# EAGLE schematic main (EAGLE 7.2.0)
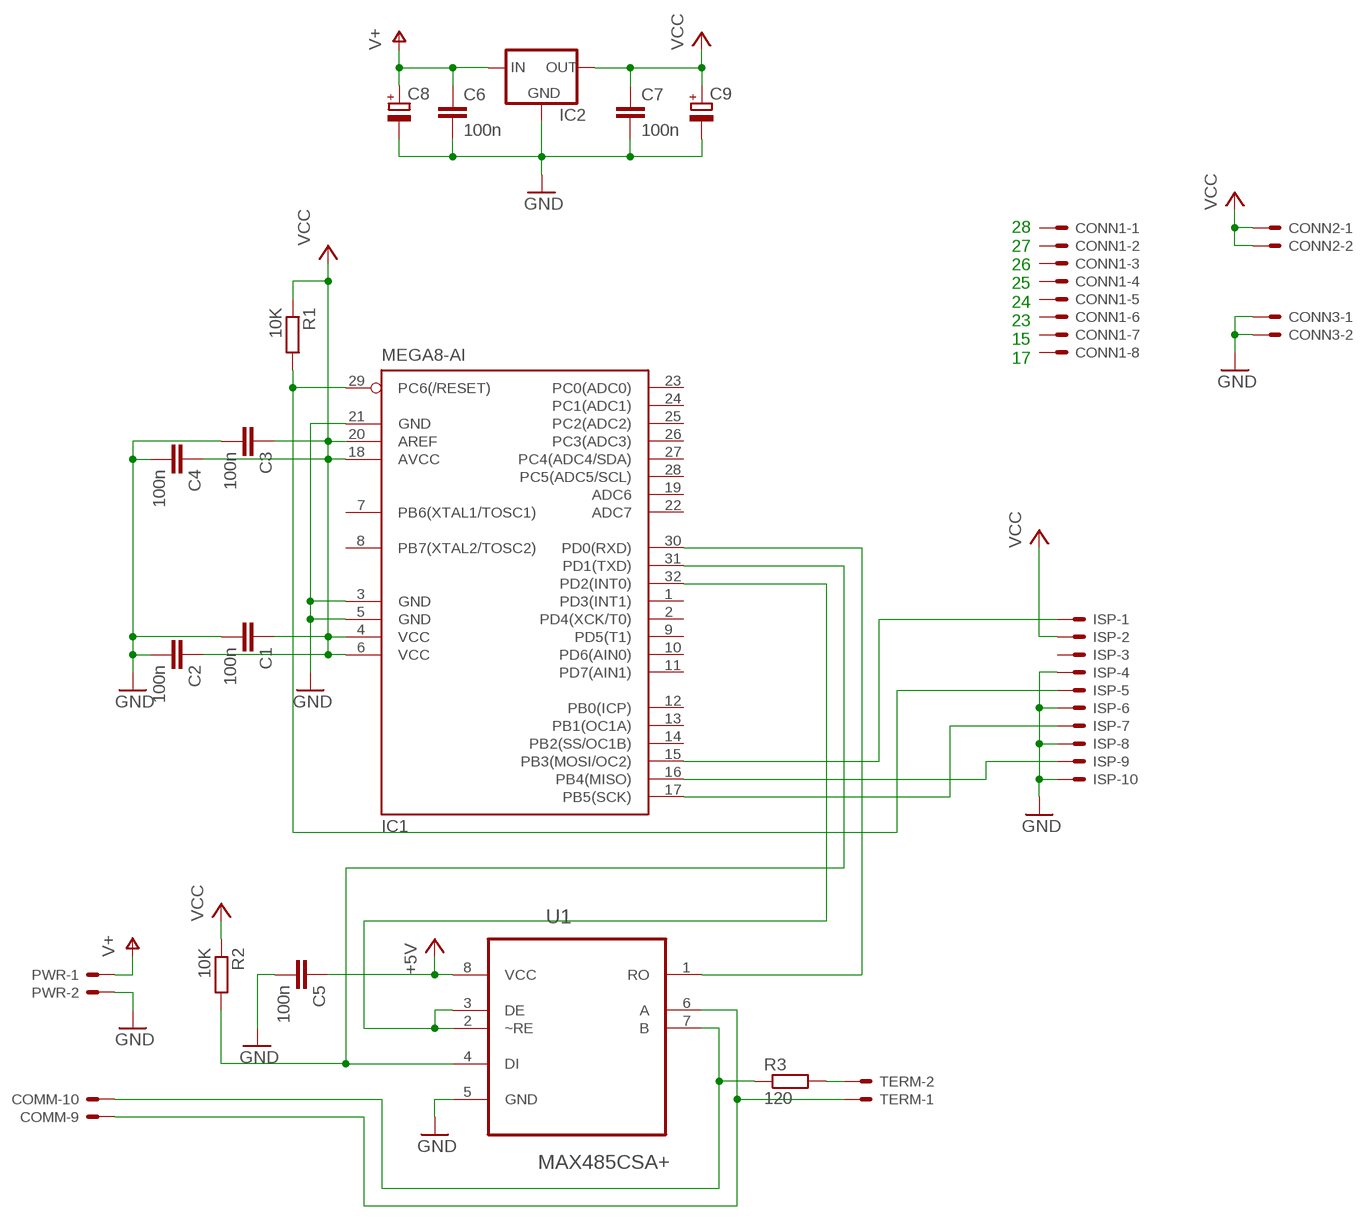
[diagram p0: schematic, sheet 1]

## Parts
C1  100n  C2,5-3  [C2.5-3]
C2  100n  C2,5-3  [C2.5-3]
C3  100n  C2,5-3  [C2.5-3]
C4  100n  C2,5-3  [C2.5-3]
C5  100n  C2,5-3  [C2.5-3]
C6  100n  C2,5-3  [C2.5-3]
C7  100n  C2,5-3  [C2.5-3]
C8  CPOL-EU085CS-1AR  [085CS_1AR]
C9  CPOL-EU085CS-1AR  [085CS_1AR]
COMM  5566-10  [5566-10]
CONN1  5566-10  [5566-10]
CONN2  5566-10  [5566-10]
CONN3  5566-10  [5566-10]
IC1  MEGA8-AI  [TQFP32-08]
IC2  78LXX  [78LXX]
ISP  5566-10  [5566-10]
PWR  5566-10  [5566-10]
R1  10K  R-EU_M1206  [M1206]
R2  10K  R-EU_M1206  [M1206]
R3  120  R-EU_M1206  [M1206]
TERM  5566-10  [5566-10]
U1  MAX485CSA+  [SOIC127P600X175-8N]

## Nets
+5V: C5.1 U1.8(VCC)
GND: C1.2 C2.2 C3.2 C4.2 C5.2 C6.2 C7.2 C8.- C9.- CONN3.1 CONN3.2 IC1.3(GND) IC1.5(GND) IC1.21(GND) IC2.GND ISP.4 ISP.6 ISP.8 ISP.10 PWR.2 U1.5(GND)
N$1: IC1.31(PD1(TXD)) R2.2 U1.4(DI)
N$2: IC1.30(PD0(RXD)) U1.1(RO)
N$3: IC1.32(PD2(INT0)) U1.2(~RE) U1.3(DE)
N$4: IC1.17(PB5(SCK)) ISP.7
N$5: COMM.10 R3.1 U1.7(B)
N$6: IC1.15(PB3(MOSI/OC2)) ISP.1
N$7: IC1.16(PB4(MISO)) ISP.9
N$8: COMM.9 TERM.1 U1.6(A)
N$9: R3.2 TERM.2
N$11: IC1.29(PC6(/RESET)) ISP.5 R1.2
V+: C6.1 C8.+ IC2.IN PWR.1
VCC: C1.1 C2.1 C3.1 C4.1 C7.1 C9.+ CONN2.1 CONN2.2 IC1.4(VCC) IC1.6(VCC) IC1.18(AVCC) IC1.20(AREF) IC2.OUT ISP.2 R1.1 R2.1
Unconnected: COMM.1 COMM.2 COMM.3 COMM.4 COMM.5 COMM.6 COMM.7 COMM.8 CONN1.1 CONN1.2 CONN1.3 CONN1.4 CONN1.5 CONN1.6 CONN1.7 CONN1.8 CONN1.9 CONN1.10 CONN2.3 CONN2.4 CONN2.5 CONN2.6 CONN2.7 CONN2.8 CONN2.9 CONN2.10 CONN3.3 CONN3.4 CONN3.5 CONN3.6 CONN3.7 CONN3.8 CONN3.9 CONN3.10 IC1.1(PD3(INT1)) IC1.2(PD4(XCK/T0)) IC1.7(PB6(XTAL1/TOSC1)) IC1.8(PB7(XTAL2/TOSC2)) IC1.9(PD5(T1)) IC1.10(PD6(AIN0)) IC1.11(PD7(AIN1)) IC1.12(PB0(ICP)) IC1.13(PB1(OC1A)) IC1.14(PB2(SS/OC1B)) IC1.19(ADC6) IC1.22(ADC7) IC1.23(PC0(ADC0)) IC1.24(PC1(ADC1)) IC1.25(PC2(ADC2)) IC1.26(PC3(ADC3)) IC1.27(PC4(ADC4/SDA)) IC1.28(PC5(ADC5/SCL)) ISP.3 PWR.3 PWR.4 PWR.5 PWR.6 PWR.7 PWR.8 PWR.9 PWR.10 TERM.3 TERM.4 TERM.5 TERM.6 TERM.7 TERM.8 TERM.9 TERM.10

## Notes on the sheet
- 28
  27
  26
  25
  24
  23
  15
  17

## Library data of the parts
C1-C7 = capacitor-wima:C: CAPACITOR naming: grid - package width
C8 C9 = rcl:CPOL-EU: POLARIZED CAPACITOR, European symbol
COMM CONN1-CONN3 ISP PWR TERM = con-molex:5566-10: Mini FIT connector 10 pol Source: http://www.molex.com; OC_FARNELL: unknown; OC_NEWARK: unknown
IC1 = atmel:MEGA8: MICROCONTROLLER 8 Kbytes FLASH, 1 kbytes SRAM, 512 bytes EEPROM, USART, 6-channel 10 bit ADC, 2-channel 8 bit ADC Pin compatible with Atmega48, ATMega88, ATMega168 Source: avr.lbr; MPN: ATMEGA8-16AU; OC_FARNELL: 9171371; OC_NEWARK: 73M8863
IC2 = v-reg:78LXX: VOLTAGE REGULATOR
R1-R3 = resistor:R-EU_: RESISTOR, European symbol
U1 = Maxim_By_element14_Batch_1:MAX485CSA+: ±15kV ESD-Protected, Slew-Rate-Limited, Low-Power, RS-485/RS-422 Transceivers; MPN: MAX485CSA+; OC_FARNELL: 9725954; OC_NEWARK: 68K4795; PACKAGE: SOIC-8; SUPPLIER: Maxim